# Altium project FIT_PM12_v1.1.PrjPcb (part 1 of 13)
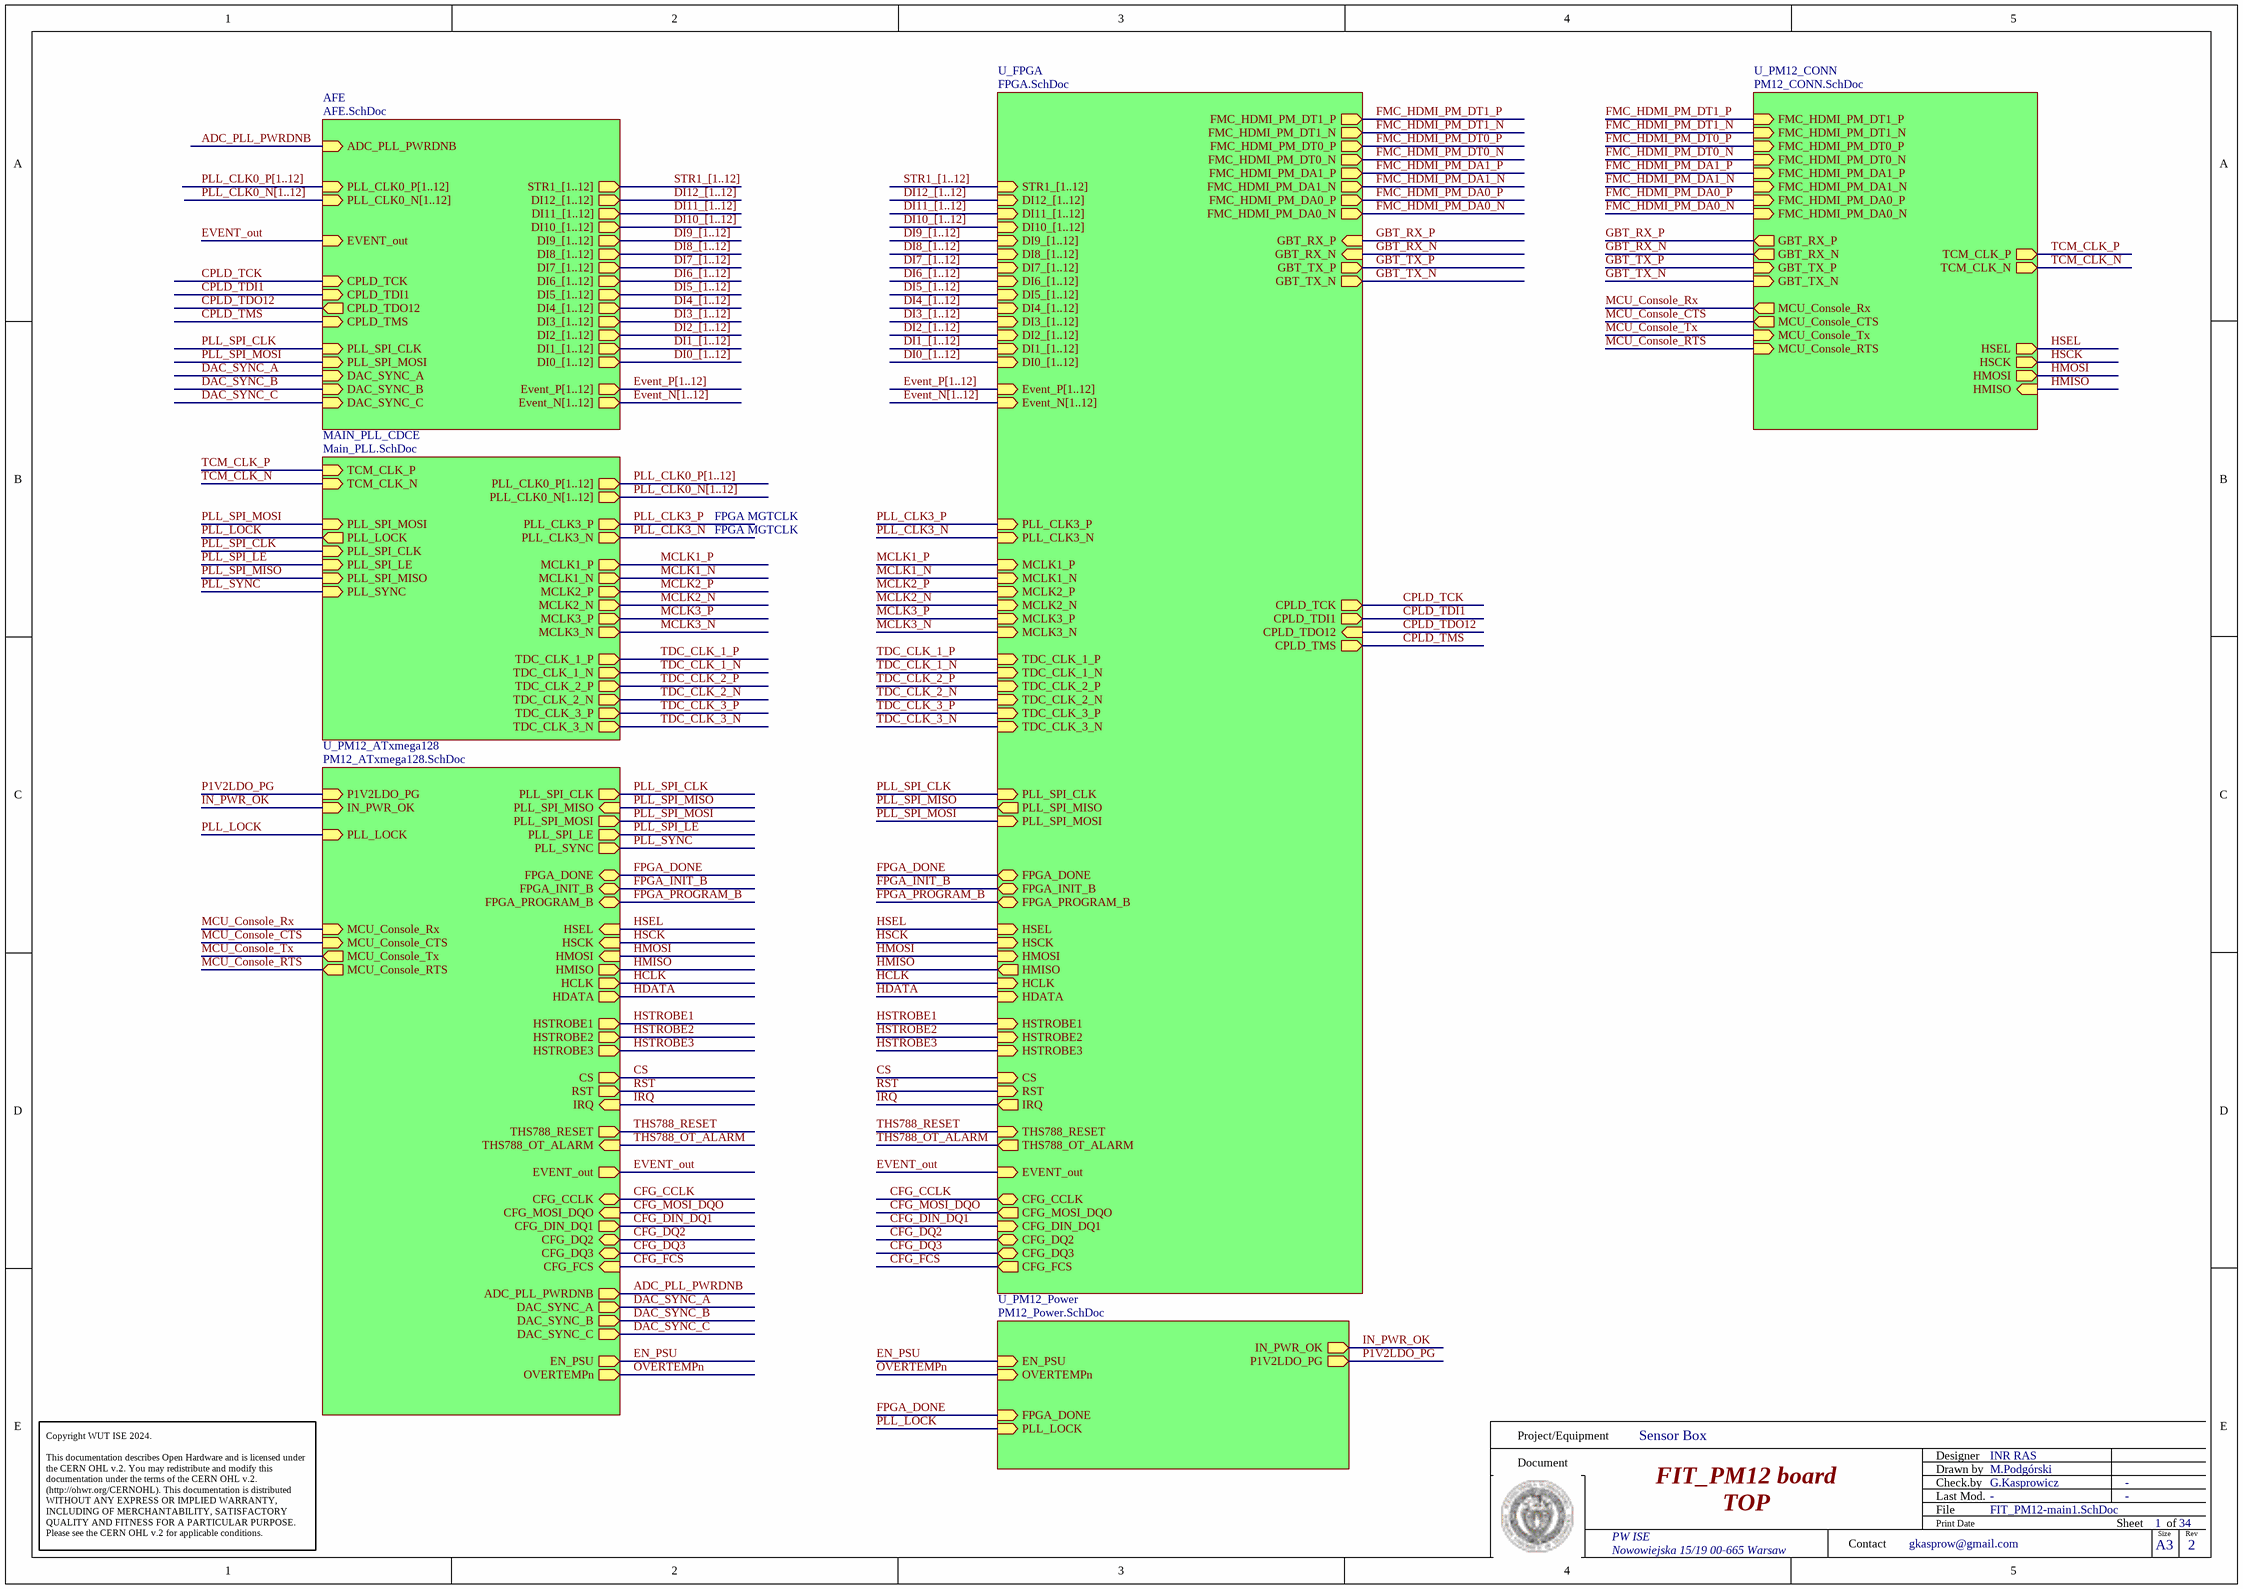
[diagram p0: FIT_PM12-main1.SchDoc]
35 sheets, 2151 parts. Net scope: hierarchical (ports join the sheet entries above them; power ports are global).
Board file: PM12_v1.1.PcbDoc
Sheets:
  FIT_PM12-main1.SchDoc
    MAIN_PLL_CDCE = Main_PLL.SchDoc
      U_ADCLK = ADCLK.SchDoc
    U_PM12_CONN = PM12_CONN.SchDoc
    U_PM12_ATxmega128 = PM12_ATxmega128.SchDoc
    U_PM12_Power = PM12_Power.SchDoc
      U_PM12_LDO = PM12_LDO.SchDoc
      U_PM12_Supply_LED = PM12_Supply_LED.SchDoc
      U_PM12_P3V8 = PM12_P3V8.SchDoc
      U_PM12_P3V3 = PM12_P3V3.SchDoc
      U_PM12_N5V5 = PM12_N5V5.SchDoc
      U_PM12_P5V5 = PM12_P5V5.SchDoc
      U_PM12_P1V0 = PM12_P1V0.SchDoc
      U_PM12_P1V8 = PM12_P1V8.SchDoc
    U_FPGA = FPGA.SchDoc
      U_FPGA_H = FPGA_H.SchDoc
        U_THS788_1 = THS788_1.SchDoc
      U_FPGA_D_F = FPGA_D_F.SchDoc
        U_THS788_3 = THS788_3.SchDoc
      U_FPGA_A_B = FPGA_A_B.SchDoc
      U_FPGA_G = FPGA_G.SchDoc
        U_THS788_2 = THS788_2.SchDoc
      U_FPGA_I_J = FPGA_I_J.SchDoc
      U_FPGA_E = FPGA_E.SchDoc
      U_FPGA_C = FPGA_C.SchDoc
      JTAG = JTAG.SchDoc
      U_FPGA_Power = FPGA_Power.SchDoc
    AFE = AFE.SchDoc
      INT1 = Integrators.SchDoc
      INT2 = Integrators.SchDoc
      INT3 = Integrators.SchDoc
      INT4 = Integrators.SchDoc
      INT5 = Integrators.SchDoc
      INT6 = Integrators.SchDoc
      INT7 = Integrators.SchDoc
      INT8 = Integrators.SchDoc
      INT9 = Integrators.SchDoc
      INT10 = Integrators.SchDoc
      INT11 = Integrators.SchDoc
      INT12 = Integrators.SchDoc
      ADC1 = ADCs.SchDoc
      ADC2 = ADCs.SchDoc
      ADC3 = ADCs.SchDoc
      ADC4 = ADCs.SchDoc
      ADC5 = ADCs.SchDoc
      ADC6 = ADCs.SchDoc
      ADC7 = ADCs.SchDoc
      ADC8 = ADCs.SchDoc
      ADC9 = ADCs.SchDoc
      ADC10 = ADCs.SchDoc
      ADC11 = ADCs.SchDoc
      ADC12 = ADCs.SchDoc
      CPLD1 = XC2C128.SchDoc
      CPLD2 = XC2C128.SchDoc
      CPLD3 = XC2C128.SchDoc
      CPLD4 = XC2C128.SchDoc
      CPLD5 = XC2C128.SchDoc
      CPLD6 = XC2C128.SchDoc
      CPLD7 = XC2C128.SchDoc
      CPLD8 = XC2C128.SchDoc
      CPLD9 = XC2C128.SchDoc
      CPLD10 = XC2C128.SchDoc
      CPLD11 = XC2C128.SchDoc
      CPLD12 = XC2C128.SchDoc
      QDC1 = DAC8554.SchDoc
      QDC2 = DAC8554.SchDoc
      QDC3 = DAC8554.SchDoc
      QDC4 = DAC8554.SchDoc
      QDC5 = DAC8554.SchDoc
      QDC6 = DAC8554.SchDoc
      QDC7 = DAC8554.SchDoc
      QDC8 = DAC8554.SchDoc
      QDC9 = DAC8554.SchDoc
      QDC10 = DAC8554.SchDoc
      QDC11 = DAC8554.SchDoc
      QDC12 = DAC8554.SchDoc
      ADC_PLL1 = ADC_PLL.SchDoc
      ADC_PLL2 = ADC_PLL.SchDoc
      ADC_PLL3 = ADC_PLL.SchDoc
      ADC_PLL4 = ADC_PLL.SchDoc
      ADC_PLL5 = ADC_PLL.SchDoc
      ADC_PLL6 = ADC_PLL.SchDoc
      ADC_PLL7 = ADC_PLL.SchDoc
      ADC_PLL8 = ADC_PLL.SchDoc
      ADC_PLL9 = ADC_PLL.SchDoc
      ADC_PLL10 = ADC_PLL.SchDoc
      ADC_PLL11 = ADC_PLL.SchDoc
      ADC_PLL12 = ADC_PLL.SchDoc
      Gate_Strobe1 = Gate_Strobe.SchDoc
      Gate_Strobe2 = Gate_Strobe.SchDoc
      Gate_Strobe3 = Gate_Strobe.SchDoc
      Gate_Strobe4 = Gate_Strobe.SchDoc
      Gate_Strobe5 = Gate_Strobe.SchDoc
      Gate_Strobe6 = Gate_Strobe.SchDoc
      Gate_Strobe7 = Gate_Strobe.SchDoc
      Gate_Strobe8 = Gate_Strobe.SchDoc
      Gate_Strobe9 = Gate_Strobe.SchDoc
      Gate_Strobe10 = Gate_Strobe.SchDoc
      Gate_Strobe11 = Gate_Strobe.SchDoc
      Gate_Strobe12 = Gate_Strobe.SchDoc
  I2C_Switch.SchDoc

## Sheet FIT_PM12-main1.SchDoc: FIT_PM12 board
size 420 x 297 mm; CheckedBy: G.Kasprowicz; Author: INR Moscow; CompanyName: WUT ISE; DrawnBy: M.Podgórski; Organization: WUT ISE; Address1: PW ISE; Address2: Nowowiejska 15/19 00-665 Warsaw; Address3: gkasprow@gmail.com; DocumentNumber: 1; Revision: 2; SheetNumber: 1; SheetTotal: 34; ModifiedBy: -; CheckedDate: -; Title2: TOP; DivGrp: WUT ISE; Designer: INR RAS; ModifiedDate: -; ProjectName: Sensor Box

### Sub-sheets
AFE = AFE.SchDoc: CPLD_TCK (in), CPLD_TMS (in), CPLD_TDI1 (in), CPLD_TDO12 (out), PLL_SPI_MOSI (in), DAC_SYNC_A (in), DAC_SYNC_B (in), DAC_SYNC_C (in), ADC_PLL_PWRDNB (in), EVENT_out (in), Event_P[1..12] (out), Event_N[1..12] (out), PLL_CLK0_P[1..12] (in), PLL_CLK0_N[1..12] (in), PLL_SPI_CLK (in), STR1_[1..12] (out), DI12_[1..12] (out), DI11_[1..12] (out), DI10_[1..12] (out), DI9_[1..12] (out), DI8_[1..12] (out), DI7_[1..12] (out), DI6_[1..12] (out), DI5_[1..12] (out), DI4_[1..12] (out), DI3_[1..12] (out), DI2_[1..12] (out), DI1_[1..12] (out), DI0_[1..12] (out)
MAIN_PLL_CDCE = Main_PLL.SchDoc: PLL_SPI_CLK (in), PLL_SPI_MISO (in), TCM_CLK_P (in), TCM_CLK_N (in), PLL_SYNC (in), PLL_LOCK (out), PLL_SPI_LE (in), PLL_SPI_MOSI (in), PLL_CLK3_P (out), PLL_CLK3_N (out), PLL_CLK0_P[1..12] (out), PLL_CLK0_N[1..12] (out), TDC_CLK_1_P (out), TDC_CLK_1_N (out), TDC_CLK_2_P (out), TDC_CLK_2_N (out), TDC_CLK_3_P (out), TDC_CLK_3_N (out), MCLK1_P (out), MCLK1_N (out), MCLK2_P (out), MCLK2_N (out), MCLK3_P (out), MCLK3_N (out)
U_FPGA = FPGA.SchDoc: FMC_HDMI_PM_DT1_P (out), FMC_HDMI_PM_DT1_N (out), FMC_HDMI_PM_DT0_P (out), FMC_HDMI_PM_DT0_N (out), FMC_HDMI_PM_DA1_P (out), FMC_HDMI_PM_DA1_N (out), FMC_HDMI_PM_DA0_P (out), FMC_HDMI_PM_DA0_N (out), HCLK (in), HDATA (in), HSTROBE3 (in), TDC_CLK_3_P (in), TDC_CLK_3_N (in), MCLK3_P (in), MCLK3_N (in), THS788_OT_ALARM (out), THS788_RESET (in), TDC_CLK_1_P (in), TDC_CLK_1_N (in), MCLK1_P (in), MCLK1_N (in), TDC_CLK_2_P (in), TDC_CLK_2_N (in), MCLK2_P (in), MCLK2_N (in), STR1_[1..12] (in), DI12_[1..12] (in), DI11_[1..12] (in), DI10_[1..12] (in), DI9_[1..12] (in), DI8_[1..12] (in), DI7_[1..12] (in), DI6_[1..12] (in), DI5_[1..12] (in), DI4_[1..12] (in), DI3_[1..12] (in), DI2_[1..12] (in), DI1_[1..12] (in), DI0_[1..12] (in), Event_P[1..12] (in), Event_N[1..12] (in), PLL_SPI_MOSI (in), PLL_SPI_CLK (in), PLL_SPI_MISO (out), CFG_MOSI_DQO (out), CFG_DIN_DQ1 (in), CFG_DQ2 (bidir), CFG_DQ3 (bidir), CFG_FCS (out), EVENT_out (in), HSEL (in), HSCK (in), HMOSI (in), HMISO (out), RST (in), CS (in), IRQ (out), PLL_CLK3_P (in), PLL_CLK3_N (in), GBT_RX_P (in), GBT_RX_N (in), GBT_TX_P (out), GBT_TX_N (out), CFG_CCLK (bidir), CPLD_TDO12 (in), FPGA_DONE (bidir), FPGA_INIT_B (bidir), FPGA_PROGRAM_B (bidir), CPLD_TCK (out), CPLD_TDI1 (out), CPLD_TMS (out), HSTROBE2 (in), HSTROBE1 (in)
U_PM12_ATxmega128 = PM12_ATxmega128.SchDoc: ADC_PLL_PWRDNB (out), PLL_SPI_MOSI (out), CFG_MOSI_DQO (in), CFG_DIN_DQ1 (out), CFG_DQ2 (bidir), CFG_DQ3 (bidir), CFG_FCS (in), CFG_CCLK (bidir), FPGA_DONE (bidir), FPGA_INIT_B (bidir), PLL_SPI_CLK (out), EVENT_out (out), PLL_SPI_MISO (in), CS (out), IRQ (in), RST (out), FPGA_PROGRAM_B (bidir), PLL_SYNC (out), PLL_LOCK (in), PLL_SPI_LE (out), IN_PWR_OK (in), MCU_Console_Rx (in), MCU_Console_CTS (in), MCU_Console_Tx (out), MCU_Console_RTS (out), EN_PSU (out), P1V2LDO_PG (in), THS788_RESET (out), THS788_OT_ALARM (in), OVERTEMPn (out), HSCK (in), HMISO (out), HSEL (in), HMOSI (in), HCLK (out), HDATA (out), HSTROBE1 (out), HSTROBE2 (out), HSTROBE3 (out), DAC_SYNC_A (out), DAC_SYNC_B (out), DAC_SYNC_C (out)
U_PM12_CONN = PM12_CONN.SchDoc: GBT_TX_P (in), GBT_TX_N (in), GBT_RX_P (out), GBT_RX_N (out), TCM_CLK_P (out), TCM_CLK_N (out), MCU_Console_Rx (out), MCU_Console_CTS (out), MCU_Console_Tx (in), MCU_Console_RTS (in), FMC_HDMI_PM_DT1_P (in), FMC_HDMI_PM_DT1_N (in), FMC_HDMI_PM_DT0_P (in), FMC_HDMI_PM_DT0_N (in), FMC_HDMI_PM_DA1_P (in), FMC_HDMI_PM_DA1_N (in), FMC_HDMI_PM_DA0_P (in), FMC_HDMI_PM_DA0_N (in), HSCK (out), HMISO (in), HSEL (out), HMOSI (out)
U_PM12_Power = PM12_Power.SchDoc: IN_PWR_OK (out), P1V2LDO_PG (out), EN_PSU (in), FPGA_DONE (in), OVERTEMPn (in), PLL_LOCK (in)

### Nets
ADC_PLL_PWRDNB: sheet U_PM12_ATxmega128/ADC_PLL_PWRDNB, sheet AFE/ADC_PLL_PWRDNB
CFG_CCLK: sheet U_PM12_ATxmega128/CFG_CCLK, sheet U_FPGA/CFG_CCLK
CFG_DIN_DQ1: sheet U_PM12_ATxmega128/CFG_DIN_DQ1, sheet U_FPGA/CFG_DIN_DQ1
CFG_DQ2: sheet U_PM12_ATxmega128/CFG_DQ2, sheet U_FPGA/CFG_DQ2
CFG_DQ3: sheet U_PM12_ATxmega128/CFG_DQ3, sheet U_FPGA/CFG_DQ3
CFG_FCS: sheet U_PM12_ATxmega128/CFG_FCS, sheet U_FPGA/CFG_FCS
CFG_MOSI_DQO: sheet U_PM12_ATxmega128/CFG_MOSI_DQO, sheet U_FPGA/CFG_MOSI_DQO
CPLD_TCK: sheet U_FPGA/CPLD_TCK, sheet AFE/CPLD_TCK
CPLD_TDI1: sheet U_FPGA/CPLD_TDI1, sheet AFE/CPLD_TDI1  [project net CPLD_TDI]
CPLD_TDO12: sheet U_FPGA/CPLD_TDO12, sheet AFE/CPLD_TDO12  [project net CPLD_TDO]
CPLD_TMS: sheet U_FPGA/CPLD_TMS, sheet AFE/CPLD_TMS
CS: sheet U_PM12_ATxmega128/CS, sheet U_FPGA/CS
DAC_SYNC_A: sheet U_PM12_ATxmega128/DAC_SYNC_A, sheet AFE/DAC_SYNC_A  [project net DAC_SYNC]
DAC_SYNC_B: sheet U_PM12_ATxmega128/DAC_SYNC_B, sheet AFE/DAC_SYNC_B  [project net DAC_SYNC]
DAC_SYNC_C: sheet U_PM12_ATxmega128/DAC_SYNC_C, sheet AFE/DAC_SYNC_C  [project net DAC_SYNC]
EN_PSU: sheet U_PM12_ATxmega128/EN_PSU, sheet U_PM12_Power/EN_PSU
EVENT_out: sheet U_PM12_ATxmega128/EVENT_out, sheet U_FPGA/EVENT_out, sheet AFE/EVENT_out  [project net EV_IN_]
FMC_HDMI_PM_DA0_N: sheet U_PM12_CONN/FMC_HDMI_PM_DA0_N, sheet U_FPGA/FMC_HDMI_PM_DA0_N
FMC_HDMI_PM_DA0_P: sheet U_PM12_CONN/FMC_HDMI_PM_DA0_P, sheet U_FPGA/FMC_HDMI_PM_DA0_P
FMC_HDMI_PM_DA1_N: sheet U_PM12_CONN/FMC_HDMI_PM_DA1_N, sheet U_FPGA/FMC_HDMI_PM_DA1_N
FMC_HDMI_PM_DA1_P: sheet U_PM12_CONN/FMC_HDMI_PM_DA1_P, sheet U_FPGA/FMC_HDMI_PM_DA1_P
FMC_HDMI_PM_DT0_N: sheet U_PM12_CONN/FMC_HDMI_PM_DT0_N, sheet U_FPGA/FMC_HDMI_PM_DT0_N
FMC_HDMI_PM_DT0_P: sheet U_PM12_CONN/FMC_HDMI_PM_DT0_P, sheet U_FPGA/FMC_HDMI_PM_DT0_P
FMC_HDMI_PM_DT1_N: sheet U_PM12_CONN/FMC_HDMI_PM_DT1_N, sheet U_FPGA/FMC_HDMI_PM_DT1_N
FMC_HDMI_PM_DT1_P: sheet U_PM12_CONN/FMC_HDMI_PM_DT1_P, sheet U_FPGA/FMC_HDMI_PM_DT1_P
FPGA_DONE: sheet U_PM12_ATxmega128/FPGA_DONE, sheet U_PM12_Power/FPGA_DONE, sheet U_FPGA/FPGA_DONE
FPGA_INIT_B: sheet U_PM12_ATxmega128/FPGA_INIT_B, sheet U_FPGA/FPGA_INIT_B
FPGA_PROGRAM_B: sheet U_PM12_ATxmega128/FPGA_PROGRAM_B, sheet U_FPGA/FPGA_PROGRAM_B
GBT_RX_N: sheet U_PM12_CONN/GBT_RX_N, sheet U_FPGA/GBT_RX_N
GBT_RX_P: sheet U_PM12_CONN/GBT_RX_P, sheet U_FPGA/GBT_RX_P
GBT_TX_N: sheet U_PM12_CONN/GBT_TX_N, sheet U_FPGA/GBT_TX_N
GBT_TX_P: sheet U_PM12_CONN/GBT_TX_P, sheet U_FPGA/GBT_TX_P
HCLK: sheet U_PM12_ATxmega128/HCLK, sheet U_FPGA/HCLK
HDATA: sheet U_PM12_ATxmega128/HDATA, sheet U_FPGA/HDATA
HMISO: sheet U_PM12_CONN/HMISO, sheet U_PM12_ATxmega128/HMISO, sheet U_FPGA/HMISO
HMOSI: sheet U_PM12_CONN/HMOSI, sheet U_PM12_ATxmega128/HMOSI, sheet U_FPGA/HMOSI
HSCK: sheet U_PM12_CONN/HSCK, sheet U_PM12_ATxmega128/HSCK, sheet U_FPGA/HSCK
HSEL: sheet U_PM12_CONN/HSEL, sheet U_PM12_ATxmega128/HSEL, sheet U_FPGA/HSEL
HSTROBE1: sheet U_PM12_ATxmega128/HSTROBE1, sheet U_FPGA/HSTROBE1
HSTROBE2: sheet U_PM12_ATxmega128/HSTROBE2, sheet U_FPGA/HSTROBE2
HSTROBE3: sheet U_PM12_ATxmega128/HSTROBE3, sheet U_FPGA/HSTROBE3
IN_PWR_OK: sheet U_PM12_ATxmega128/IN_PWR_OK, sheet U_PM12_Power/IN_PWR_OK
IRQ: sheet U_PM12_ATxmega128/IRQ, sheet U_FPGA/IRQ
MCLK1_N: sheet MAIN_PLL_CDCE/MCLK1_N, sheet U_FPGA/MCLK1_N
MCLK1_P: sheet MAIN_PLL_CDCE/MCLK1_P, sheet U_FPGA/MCLK1_P
MCLK2_N: sheet MAIN_PLL_CDCE/MCLK2_N, sheet U_FPGA/MCLK2_N
MCLK2_P: sheet MAIN_PLL_CDCE/MCLK2_P, sheet U_FPGA/MCLK2_P
MCLK3_N: sheet MAIN_PLL_CDCE/MCLK3_N, sheet U_FPGA/MCLK3_N
MCLK3_P: sheet MAIN_PLL_CDCE/MCLK3_P, sheet U_FPGA/MCLK3_P
MCU_Console_CTS: sheet U_PM12_CONN/MCU_Console_CTS, sheet U_PM12_ATxmega128/MCU_Console_CTS
MCU_Console_RTS: sheet U_PM12_CONN/MCU_Console_RTS, sheet U_PM12_ATxmega128/MCU_Console_RTS
MCU_Console_Rx: sheet U_PM12_CONN/MCU_Console_Rx, sheet U_PM12_ATxmega128/MCU_Console_Rx
MCU_Console_Tx: sheet U_PM12_CONN/MCU_Console_Tx, sheet U_PM12_ATxmega128/MCU_Console_Tx
OVERTEMPn: sheet U_PM12_ATxmega128/OVERTEMPn, sheet U_PM12_Power/OVERTEMPn
P1V2LDO_PG: sheet U_PM12_ATxmega128/P1V2LDO_PG, sheet U_PM12_Power/P1V2LDO_PG
PLL_CLK3_N: sheet MAIN_PLL_CDCE/PLL_CLK3_N, sheet U_FPGA/PLL_CLK3_N
PLL_CLK3_P: sheet MAIN_PLL_CDCE/PLL_CLK3_P, sheet U_FPGA/PLL_CLK3_P
PLL_LOCK: sheet MAIN_PLL_CDCE/PLL_LOCK, sheet U_PM12_ATxmega128/PLL_LOCK, sheet U_PM12_Power/PLL_LOCK
PLL_SPI_CLK: sheet MAIN_PLL_CDCE/PLL_SPI_CLK, sheet U_PM12_ATxmega128/PLL_SPI_CLK, sheet U_FPGA/PLL_SPI_CLK, sheet AFE/PLL_SPI_CLK
PLL_SPI_LE: sheet MAIN_PLL_CDCE/PLL_SPI_LE, sheet U_PM12_ATxmega128/PLL_SPI_LE
PLL_SPI_MISO: sheet MAIN_PLL_CDCE/PLL_SPI_MISO, sheet U_PM12_ATxmega128/PLL_SPI_MISO, sheet U_FPGA/PLL_SPI_MISO
PLL_SPI_MOSI: sheet MAIN_PLL_CDCE/PLL_SPI_MOSI, sheet U_PM12_ATxmega128/PLL_SPI_MOSI, sheet U_FPGA/PLL_SPI_MOSI, sheet AFE/PLL_SPI_MOSI
PLL_SYNC: sheet MAIN_PLL_CDCE/PLL_SYNC, sheet U_PM12_ATxmega128/PLL_SYNC
RST: sheet U_PM12_ATxmega128/RST, sheet U_FPGA/RST
TCM_CLK_N: sheet MAIN_PLL_CDCE/TCM_CLK_N, sheet U_PM12_CONN/TCM_CLK_N
TCM_CLK_P: sheet MAIN_PLL_CDCE/TCM_CLK_P, sheet U_PM12_CONN/TCM_CLK_P
TDC_CLK_1_N: sheet MAIN_PLL_CDCE/TDC_CLK_1_N, sheet U_FPGA/TDC_CLK_1_N
TDC_CLK_1_P: sheet MAIN_PLL_CDCE/TDC_CLK_1_P, sheet U_FPGA/TDC_CLK_1_P
TDC_CLK_2_N: sheet MAIN_PLL_CDCE/TDC_CLK_2_N, sheet U_FPGA/TDC_CLK_2_N
TDC_CLK_2_P: sheet MAIN_PLL_CDCE/TDC_CLK_2_P, sheet U_FPGA/TDC_CLK_2_P
TDC_CLK_3_N: sheet MAIN_PLL_CDCE/TDC_CLK_3_N, sheet U_FPGA/TDC_CLK_3_N
TDC_CLK_3_P: sheet MAIN_PLL_CDCE/TDC_CLK_3_P, sheet U_FPGA/TDC_CLK_3_P
THS788_OT_ALARM: sheet U_PM12_ATxmega128/THS788_OT_ALARM, sheet U_FPGA/THS788_OT_ALARM
THS788_RESET: sheet U_PM12_ATxmega128/THS788_RESET, sheet U_FPGA/THS788_RESET

### Buses and harness runs
bus DI0_[1..12] = sheet AFE/DI0_[1..12]
bus DI0_[1..12] = sheet U_FPGA/DI0_[1..12]
bus DI1_[1..12] = sheet AFE/DI1_[1..12]
bus DI1_[1..12] = sheet U_FPGA/DI1_[1..12]
bus DI2_[1..12] = sheet AFE/DI2_[1..12]
bus DI2_[1..12] = sheet U_FPGA/DI2_[1..12]
bus DI3_[1..12] = sheet AFE/DI3_[1..12]
bus DI3_[1..12] = sheet U_FPGA/DI3_[1..12]
bus DI4_[1..12] = sheet AFE/DI4_[1..12]
bus DI4_[1..12] = sheet U_FPGA/DI4_[1..12]
bus DI5_[1..12] = sheet AFE/DI5_[1..12]
bus DI5_[1..12] = sheet U_FPGA/DI5_[1..12]
bus DI6_[1..12] = sheet AFE/DI6_[1..12]
bus DI6_[1..12] = sheet U_FPGA/DI6_[1..12]
bus DI7_[1..12] = sheet AFE/DI7_[1..12]
bus DI7_[1..12] = sheet U_FPGA/DI7_[1..12]
bus DI8_[1..12] = sheet AFE/DI8_[1..12]
bus DI8_[1..12] = sheet U_FPGA/DI8_[1..12]
bus DI9_[1..12] = sheet AFE/DI9_[1..12]
bus DI9_[1..12] = sheet U_FPGA/DI9_[1..12]
bus DI10_[1..12] = sheet AFE/DI10_[1..12]
bus DI10_[1..12] = sheet U_FPGA/DI10_[1..12]
bus DI11_[1..12] = sheet AFE/DI11_[1..12]
bus DI11_[1..12] = sheet U_FPGA/DI11_[1..12]
bus DI12_[1..12] = sheet AFE/DI12_[1..12]
bus DI12_[1..12] = sheet U_FPGA/DI12_[1..12]
bus Event_N[1..12] = sheet AFE/Event_N[1..12]
bus Event_N[1..12] = sheet U_FPGA/Event_N[1..12]
bus Event_P[1..12] = sheet AFE/Event_P[1..12]
bus Event_P[1..12] = sheet U_FPGA/Event_P[1..12]
bus PLL_CLK0_N[1..12] = sheet AFE/PLL_CLK0_N[1..12]
bus PLL_CLK0_N[1..12] = sheet MAIN_PLL_CDCE/PLL_CLK0_N[1..12]
bus PLL_CLK0_P[1..12] = sheet AFE/PLL_CLK0_P[1..12]
bus PLL_CLK0_P[1..12] = sheet MAIN_PLL_CDCE/PLL_CLK0_P[1..12]
bus STR1_[1..12] = sheet AFE/STR1_[1..12]
bus STR1_[1..12] = sheet U_FPGA/STR1_[1..12]

### Notes on the sheet
- FPGA MGTCLK
- Project/Equipment
- Document
- Designer
- Drawn by
- Check.by
- Copyright WUT ISE 2024.
  This documentation describes Open Hardware and is licensed under the CERN OHL v.2. You may redistribute and modify this documentation under the terms of the CERN OHL v.2. (http://ohwr.org/CERNOHL). This documentation is distributed WITHOUT ANY EXPRESS OR IMPLIED WARRANTY, INCLUDING OF MERCHANTABILITY, SATISFACTORY QUALITY AND FITNESS FOR A PARTICULAR PURPOSE. Please see the CERN OHL v.2 for applicable conditions.
- Contact
- File
- Last Mod.
- Print Date
- Sheet
- Size
- A3
- of
- Rev

## Sheet Main_PLL.SchDoc: FIT_PM12 board
size 420 x 297 mm; CheckedBy: G.Kasprowicz; Author: INR Moscow; CompanyName: WUT ISE; DrawnBy: M.Podgórski; Organization: WUT ISE; Address1: PW ISE; Address2: Nowowiejska 15/19 00-665 Warsaw; Address3: gkasprow@gmail.com; DocumentNumber: 9; Revision: 2; SheetNumber: 2; SheetTotal: 34; ModifiedBy: -; CheckedDate: -; Title2: Clocking; DivGrp: WUT ISE; Designer: INR RAS; ModifiedDate: -; ProjectName: Sensor Box
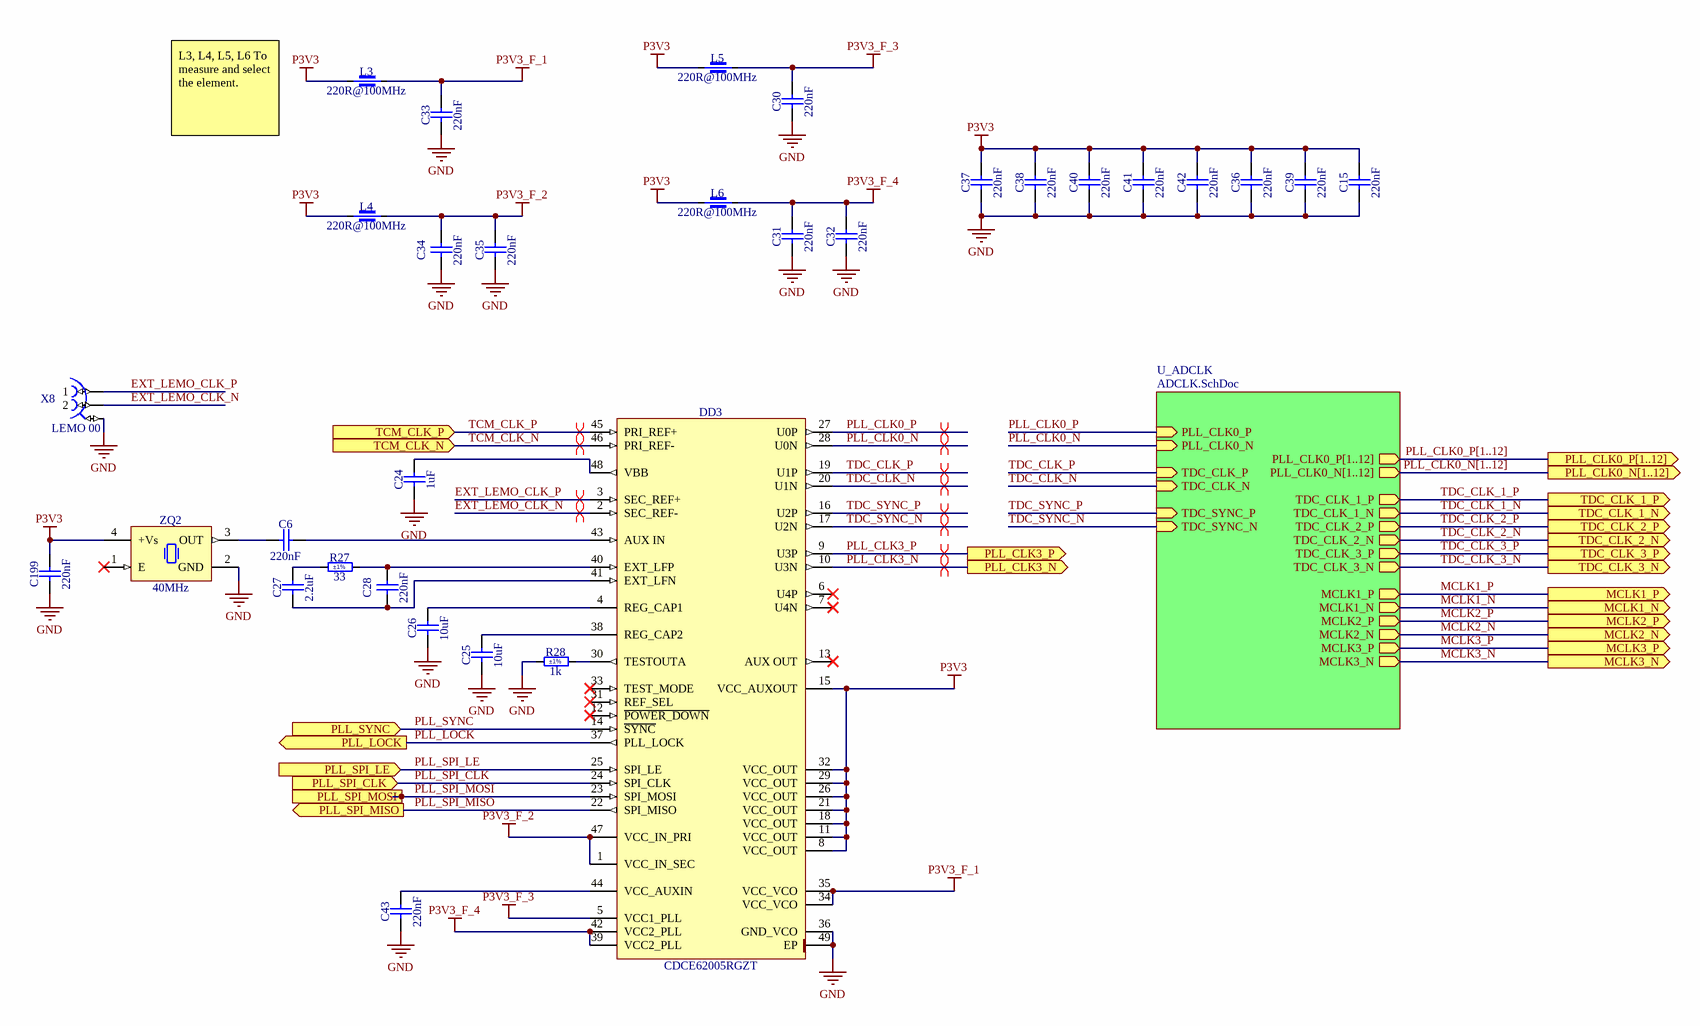
[diagram p1: Main_PLL.SchDoc]

### Parts
C6  220nF  [CAPC2012X135N]
C15  220nF  [CAPC2012X135N]
C24  1uF  [CAPC2012X140N]
C25  10uF  [CAPC2012X145N]
C26  10uF  [CAPC2012X145N]
C27  2.2uF  [CAPC2012X140N]
C28  220nF  [CAPC2012X135N]
C30  220nF  [CAPC2012X135N]
C31  220nF  [CAPC2012X135N]
C32  220nF  [CAPC2012X135N]
C33  220nF  [CAPC2012X135N]
C34  220nF  [CAPC2012X135N]
C35  220nF  [CAPC2012X135N]
C36  220nF  [CAPC2012X135N]
C37  220nF  [CAPC2012X135N]
C38  220nF  [CAPC2012X135N]
C39  220nF  [CAPC2012X135N]
C40  220nF  [CAPC2012X135N]
C41  220nF  [CAPC2012X135N]
C42  220nF  [CAPC2012X135N]
C43  220nF  [CAPC2012X135N]
C199  220nF  [CAPC2012X135N]
DD3  CDCE62005RGZT  [QFN50P700X700X100-49N-S570]
L3  220R@100MHz  [INDC2012X105N]
L4  220R@100MHz  [INDC2012X105N]
L5  220R@100MHz  [INDC2012X105N]
L6  220R@100MHz  [INDC2012X105N]
R27  33  Tolerance: ±1%  [RESC2012X60N]
R28  1k  Tolerance: ±1%  [RESC2012X60N]
X8  LEMO 00  [LEMO_EPG.00.302.NLN]
ZQ2  40MHz  [OSC_IQD_CFPS-73]

### Sub-sheets
U_ADCLK = ADCLK.SchDoc: PLL_CLK0_P[1..12] (out), PLL_CLK0_N[1..12] (out), PLL_CLK0_P (in), PLL_CLK0_N (in), TDC_CLK_N (in), TDC_CLK_P (in), TDC_SYNC_N (in), TDC_SYNC_P (in), TDC_CLK_1_P (out), TDC_CLK_1_N (out), TDC_CLK_3_P (out), TDC_CLK_3_N (out), TDC_CLK_2_P (out), TDC_CLK_2_N (out), MCLK3_P (out), MCLK3_N (out), MCLK2_P (out), MCLK2_N (out), MCLK1_P (out), MCLK1_N (out)

### Ports
MCLK1_N (out), MCLK1_P (out), MCLK2_N (out), MCLK2_P (out), MCLK3_N (out), MCLK3_P (out), PLL_CLK0_N[1..12] (out), PLL_CLK0_P[1..12] (out), PLL_CLK3_N (out), PLL_CLK3_P (out), PLL_LOCK (out), PLL_SPI_CLK (in), PLL_SPI_LE (in), PLL_SPI_MISO (out), PLL_SPI_MOSI (in), PLL_SYNC (in), TCM_CLK_N (in), TCM_CLK_P (in), TDC_CLK_1_N (out), TDC_CLK_1_P (out), TDC_CLK_2_N (out), TDC_CLK_2_P (out), TDC_CLK_3_N (out), TDC_CLK_3_P (out)

### Nets
GND: C15.1 C24.1 C25.1 C26.1 C30.1 C31.1 C32.1 C33.1 C34.1 C35.1 C36.1 C37.1 C38.1 C39.1 C40.1 C41.1 C42.1 C43.1 C199.1 DD3.36(GND_VCO) DD3.49(EP) R28.1 X8.3 ZQ2.2(GND)
P3V3: C15.2 C36.2 C37.2 C38.2 C39.2 C40.2 C41.2 C42.2 C199.2 DD3.8(VCC_OUT) DD3.11(VCC_OUT) DD3.15(VCC_AUXOUT) DD3.18(VCC_OUT) DD3.21(VCC_OUT) DD3.26(VCC_OUT) DD3.29(VCC_OUT) DD3.32(VCC_OUT) L3.1 L4.1 L5.1 L6.1 ZQ2.4(+Vs)
P3V3_F_1: C33.2 DD3.34(VCC_VCO) DD3.35(VCC_VCO) L3.2
P3V3_F_2: C34.2 C35.2 DD3.1(VCC_IN_SEC) DD3.47(VCC_IN_PRI) L4.2
P3V3_F_3: C30.2 DD3.5(VCC1_PLL) L5.2
P3V3_F_4: C31.2 C32.2 DD3.39(VCC2_PLL) DD3.42(VCC2_PLL) L6.2
EXT_LEMO_CLK_N: DD3.2(SEC_REF-) X8.2
EXT_LEMO_CLK_P: DD3.3(SEC_REF+) X8.1
MCLK1_N: port MCLK1_N, sheet U_ADCLK/MCLK1_N
MCLK1_P: port MCLK1_P, sheet U_ADCLK/MCLK1_P
MCLK2_N: port MCLK2_N, sheet U_ADCLK/MCLK2_N
MCLK2_P: port MCLK2_P, sheet U_ADCLK/MCLK2_P
MCLK3_N: port MCLK3_N, sheet U_ADCLK/MCLK3_N
MCLK3_P: port MCLK3_P, sheet U_ADCLK/MCLK3_P
PLL_CLK0_N: DD3.28(U0N) ; sheet U_ADCLK/PLL_CLK0_N
PLL_CLK0_P: DD3.27(U0P) ; sheet U_ADCLK/PLL_CLK0_P
PLL_CLK3_N: DD3.10(U3N) ; port PLL_CLK3_N
PLL_CLK3_P: DD3.9(U3P) ; port PLL_CLK3_P
PLL_LOCK: DD3.37(PLL_LOCK) ; port PLL_LOCK
PLL_SPI_CLK: DD3.24(SPI_CLK) ; port PLL_SPI_CLK
PLL_SPI_LE: DD3.25(SPI_LE) ; port PLL_SPI_LE
PLL_SPI_MISO: DD3.22(SPI_MISO) ; port PLL_SPI_MISO
PLL_SPI_MOSI: DD3.23(SPI_MOSI) ; port PLL_SPI_MOSI
PLL_SYNC: DD3.14(~{SYNC}) ; port PLL_SYNC
TCM_CLK_N: DD3.46(PRI_REF-) ; port TCM_CLK_N
TCM_CLK_P: DD3.45(PRI_REF+) ; port TCM_CLK_P
TDC_CLK_1_N: port TDC_CLK_1_N, sheet U_ADCLK/TDC_CLK_1_N
TDC_CLK_1_P: port TDC_CLK_1_P, sheet U_ADCLK/TDC_CLK_1_P
TDC_CLK_2_N: port TDC_CLK_2_N, sheet U_ADCLK/TDC_CLK_2_N
TDC_CLK_2_P: port TDC_CLK_2_P, sheet U_ADCLK/TDC_CLK_2_P
TDC_CLK_3_N: port TDC_CLK_3_N, sheet U_ADCLK/TDC_CLK_3_N
TDC_CLK_3_P: port TDC_CLK_3_P, sheet U_ADCLK/TDC_CLK_3_P
TDC_CLK_N: DD3.20(U1N) ; sheet U_ADCLK/TDC_CLK_N
TDC_CLK_P: DD3.19(U1P) ; sheet U_ADCLK/TDC_CLK_P
TDC_SYNC_N: DD3.17(U2N) ; sheet U_ADCLK/TDC_SYNC_N
TDC_SYNC_P: DD3.16(U2P) ; sheet U_ADCLK/TDC_SYNC_P
NetC6_1: C6.1 ZQ2.3(OUT)
NetC6_2: C6.2 DD3.43(AUX_IN)
NetC24_2: C24.2 DD3.48(VBB)
NetC25_2: C25.2 DD3.38(REG_CAP2)
NetC26_2: C26.2 DD3.4(REG_CAP1)
NetC27_1: C27.1 C28.1 DD3.41(EXT_LFN)
NetC27_2: C27.2 R27.1
NetC28_2: C28.2 DD3.40(EXT_LFP) R27.2
NetC43_2: C43.2 DD3.44(VCC_AUXIN)
NetDD3_30: DD3.30(TESTOUTA) R28.2

Not connected (* = marked no-connect by the designer): DD3 6(U4P)* 7(U4N)* 12(~{POWER_DOWN})* 13(AUX_OUT)* 31(REF_SEL)* 33(TEST_MODE)*; ZQ2 1(E)*

### Buses and harness runs
bus PLL_CLK0_N[1..12] = port PLL_CLK0_N[1..12] = sheet U_ADCLK/PLL_CLK0_N[1..12]
bus PLL_CLK0_P[1..12] = port PLL_CLK0_P[1..12] = sheet U_ADCLK/PLL_CLK0_P[1..12]

### Layout directives
differential pair: EXT_LEMO_CLK_N, EXT_LEMO_CLK_P, PLL_CLK0_N, PLL_CLK0_P, PLL_CLK3_N, PLL_CLK3_P, TCM_CLK_N, TCM_CLK_P, TDC_CLK_N, TDC_CLK_P, TDC_SYNC_N, TDC_SYNC_P

### Notes on the sheet
- L3, L4, L5, L6 To measure and select the element.
- Project/Equipment
- Document
- Designer
- Drawn by
- Check.by
- Copyright WUT ISE 2024.
  This documentation describes Open Hardware and is licensed under the CERN OHL v.2. You may redistribute and modify this documentation under the terms of the CERN OHL v.2. (http://ohwr.org/CERNOHL). This documentation is distributed WITHOUT ANY EXPRESS OR IMPLIED WARRANTY, INCLUDING OF MERCHANTABILITY, SATISFACTORY QUALITY AND FITNESS FOR A PARTICULAR PURPOSE. Please see the CERN OHL v.2 for applicable conditions.
- Contact
- File
- Last Mod.
- Print Date
- Sheet
- Size
- A3
- of
- Rev

### Library data of the parts
C6 C15 C28 C30-C43 C199 = CC0805_220NF_50V_10%_X7R: Non-polarised capacitor; Part Description: SMD Multilayer Chip Ceramic Capacitor; Manufacturer: GENERIC; Manufacturer1 Part Number: GRM21BR71H224KA01L; Voltage: 50V; TC: X7R; Tolerance: ±10%; Part Number: CC0805_220NF_50V_10%_X7R; Component Kind: Standard; Component Type: Standard; Pin Count: 2; Value: 220nF; Status: Preferred; Manufacturer Part Number: CC0805_220NF_50V_10%_X7R; Case: 0805; Mounted: Yes; Socket: No; SMD: Yes; Sense: No; Manufacturer1 Example: MURATA; Manufacturer1 ComponentHeight: 1.35mm; HelpURL: \\cern.ch\dfs\Applications\Altium\Datasheets\CC0805_X7R_MURATA.pdf; Author: CERN DEM JLC; CreateDate: 03.12.2007; LatestRevisionDate: 03.12.2007
C24 = CC0805_1UF_25V_10%_X7R: Non-polarised capacitor; Part Description: SMD Multilayer Chip Ceramic Capacitor; Manufacturer: GENERIC; Manufacturer1 Part Number: C0805C105K3RAC; Voltage: 25V; TC: X7R; Tolerance: ±10%; Part Number: CC0805_1UF_25V_10%_X7R; Component Kind: Standard; Component Type: Standard; Pin Count: 2; Value: 1uF; Status: Preferred; Manufacturer Part Number: CC0805_1UF_25V_10%_X7R; Case: 0805; Mounted: Yes; Socket: No; SMD: Yes; Sense: No; Manufacturer1 Example: KEMET; Manufacturer1 ComponentHeight: 1.4mm; HelpURL: \\cern.ch\dfs\Applications\Altium\Datasheets\CC0805_X7R_KEMET.pdf; Author: CERN DEM JLC; CreateDate: 23.03.2009; LatestRevisionDate: 23.03.2009
C25 C26 = CC0805_10UF_25V_10%_X7R: Non-polarised capacitor; Part Description: SMD Multilayer Chip Ceramic Capacitor; Manufacturer: GENERIC; Manufacturer1 Part Number: GRM21BZ71E106KE15; Voltage: 25V; TC: X7R; Tolerance: ±10%; Part Number: CC0805_10UF_25V_10%_X7R; Component Kind: Standard; Component Type: Standard; Pin Count: 2; Value: 10uF; Status: Preferred; Manufacturer Part Number: CC0805_10UF_25V_10%_X7R; Case: 0805; Mounted: Yes; Socket: No; SMD: Yes; Sense: No; Manufacturer1 Example: MURATA; Manufacturer1 ComponentHeight: 1.45mm; HelpURL: \\cern.ch\dfs\Applications\Altium\Datasheets\CC0805_MURATA_GRM21BZ71E106KE15.pdf; Author: CERN DEM HF; CreateDate: 16.05.2023; LatestRevisionDate: 16.05.2023
C27 = CC0805_2.2UF_50V_10%_X7R: Non-polarised capacitor; Part Description: SMD Multilayer Chip Ceramic Capacitor; Manufacturer: GENERIC; Manufacturer1 Part Number: GRM21BR61H225KA73L; Voltage: 50V; TC: X7R; Tolerance: ±10%; Part Number: CC0805_2.2UF_50V_10%_X7R; Component Kind: Standard; Component Type: Standard; Pin Count: 2; Value: 2.2uF; Status: Preferred; Manufacturer Part Number: CC0805_2.2UF_50V_10%_X7R; Case: 0805; Mounted: Yes; Socket: No; SMD: Yes; Sense: No; Manufacturer1 Example: MURATA; Manufacturer1 ComponentHeight: 1.40mm; HelpURL: \\cern.ch\dfs\Applications\Altium\Datasheets\CC0805_X7R_MURATA_GRM.pdf; Author: CERN DEM JLC; CreateDate: 18.08.2014; LatestRevisionDate: 18.08.2014
DD3 = CDCE62005RGZT: 5/10 Outputs Clock Generator/Jitter Cleaner with Integrated Dual VCO; Manufacturer: TEXAS INSTRUMENTS; PressFit: No; Bonding: No; Part Number: CDCE62005RGZT; Component Kind: Standard; Component Type: Standard; Device: CDCE62005RGZT; PackageDescription: QFN, 0.50mm Pitch, Square; 48 Pin, 7.00mm L X 7.00mm W X 1.00mm H body (w/Thermal Tab 5.70 X 5.70mm), IPC Medium Density; Part Description: 5/10 Outputs Clock Generator/Jitter Cleaner with Integrated Dual VCO; Manufacturer Part Number: CDCE62005RGZ; Pin Count: 49; Case: QFN48; Mounted: Yes; Socket: No; SMD: Yes; Sense: No; ComponentHeight: 1mm; HelpURL: \\cern.ch\dfs\Applications\Altium\Datasheets\CDCE62005RGZT.pdf; Author: CERN DEM JLC; CreateDate: 21.11.2011; LatestRevisionDate: 10.06.2022
L3-L6 = IND0805_TDK_MPZ2012S221A: Part Description: SMT Chip Bead for General Power Line (MPZ Series); Manufacturer: TDK; Power: 3A; Resistance: 0.04R; Tolerance: ±25%; Part Number: IND0805_TDK_MPZ2012S221A; Component Kind: Standard; Component Type: Standard; Pin Count: 2; Value: 220R@100MHz; Manufacturer Part Number: MPZ2012S221A; Case: 0805; Mounted: Yes; Socket: No; SMD: Yes; Sense: No; ComponentHeight: 1.05mm; HelpURL: \\cern.ch\dfs\Applications\Altium\Datasheets\IND0805_TDK_MPZ2012.pdf; Author: CERN DEM HF; CreateDate: 04.10.2021; LatestRevisionDate: 04.10.2021
R27 = R0805_33R_1%_0.125W_100PPM: Resistor - 1%; Part Description: General Purpose Thick Film Chip Resistor; Manufacturer: GENERIC; Manufacturer1 Part Number: NRC10F33R0TRF; Power: 0.125W; TC: ±100ppm/°C; PressFit: No; Part Number: R0805_33R_1%_0.125W_100PPM; Component Kind: Standard; Component Type: Standard; Pin Count: 2; Value: 33; Status: Preferred; Manufacturer Part Number: R0805_33R_1%_0.125W_100PPM; Case: 0805; Mounted: Yes; Sense: No; Socket: No; SMD: Yes; Manufacturer1 Example: NIC COMPONENT; Manufacturer1 ComponentHeight: 0.6mm; HelpURL: \\cern.ch\dfs\Applications\Altium\Datasheets\R0805_NIC_NRC.pdf; Author: CERN DEM JLC; CreateDate: 03.12.2007; LatestRevisionDate: 13.03.2008
R28 = R0805_1K_1%_0.125W_100PPM: Resistor - 1%; Part Description: General Purpose Thick Film Chip Resistor; Manufacturer: GENERIC; Manufacturer1 Part Number: NRC10F1001TRF; Power: 0.125W; TC: ±100ppm/°C; PressFit: No; Part Number: R0805_1K_1%_0.125W_100PPM; Component Kind: Standard; Component Type: Standard; Pin Count: 2; Value: 1k; Status: Preferred; Manufacturer Part Number: R0805_1K_1%_0.125W_100PPM; Case: 0805; Mounted: Yes; Sense: No; Socket: No; SMD: Yes; Manufacturer1 Example: NIC COMPONENT; Manufacturer1 ComponentHeight: 0.6mm; HelpURL: \\cern.ch\dfs\Applications\Altium\Datasheets\R0805_NIC_NRC.pdf; Author: CERN DEM JLC; CreateDate: 03.12.2007; LatestRevisionDate: 13.03.2008
X8 = LEMO_EPG.00.302.NLN: Part Description: Size 00, Elbow Socket (90°) with 2 Female Contacts and Alignment Key (G); PressFit: No; SCEM: 09.31.28.007.2; Part Number: LEMO_EPG.00.302.NLN; Component Kind: Standard; Component Type: Standard; Pin Count: 3; Family: LEMO 00; Mounted: Yes; Socket: No; SMD: No; Sense: No; Status: None; Manufacturer: LEMO; Manufacturer Part Number: EPG.00.302.NLN; ComponentHeight: 7mm; HelpURL: \\cern.ch\dfs\Applications\Altium\Datasheets\LEMO_EPG.00.302.NLN.pdf; Author: CERN DEM JLC; CreateDate: 25.08.2010; LatestRevisionDate: 20.12.2010
ZQ2 = OSC_40MHZ_IQD_LFSPXO018042: Oscillator 4 pins 1=E 2=GND 3=OUT 4=+Vs; Part Description: 3.3V, ±50ppm, 50pF, 0..70°C, HCMOS Surface Mount Clock Oscillator (CFPS-73 Series); Manufacturer: IQD FREQUENCY PRODUCTS; PressFit: No; Bonding: No; Part Number: OSC_40MHZ_IQD_LFSPXO018042; Component Kind: Standard; Component Type: Standard; PackageDescription: Oscillator, Side Concave, 5.08mm Pitch, 4 Pins, 5.00mm L X 7.00mm W X 1.40mm H, CFPS-73 Series; Value: 40MHz; Manufacturer Part Number: LFSPXO018042; Pin Count: 4; Mounted: Yes; Socket: No; SMD: Yes; Sense: No; ComponentHeight: 1.4mm; HelpURL: \\cern.ch\dfs\Applications\Altium\Datasheets\OSC_IQD_LFSPXO018042.pdf; Author: CERN DEM JLC; CreateDate: 22.08.2011; LatestRevisionDate: 03.11.2016

## Sheet ADCLK.SchDoc: FIT_PM12 board
size 420 x 297 mm; CheckedBy: G.Kasprowicz; Author: INR Moscow; CompanyName: WUT ISE; DrawnBy: M.Podgórski; Organization: WUT ISE; Address1: PW ISE; Address2: Nowowiejska 15/19 00-665 Warsaw; Address3: gkasprow@gmail.com; DocumentNumber: 10; Revision: 2; SheetNumber: 3; SheetTotal: 34; ModifiedBy: -; CheckedDate: -; Title2: clock distribution; DivGrp: WUT ISE; Designer: INR RAS; ModifiedDate: -; ProjectName: Sensor Box
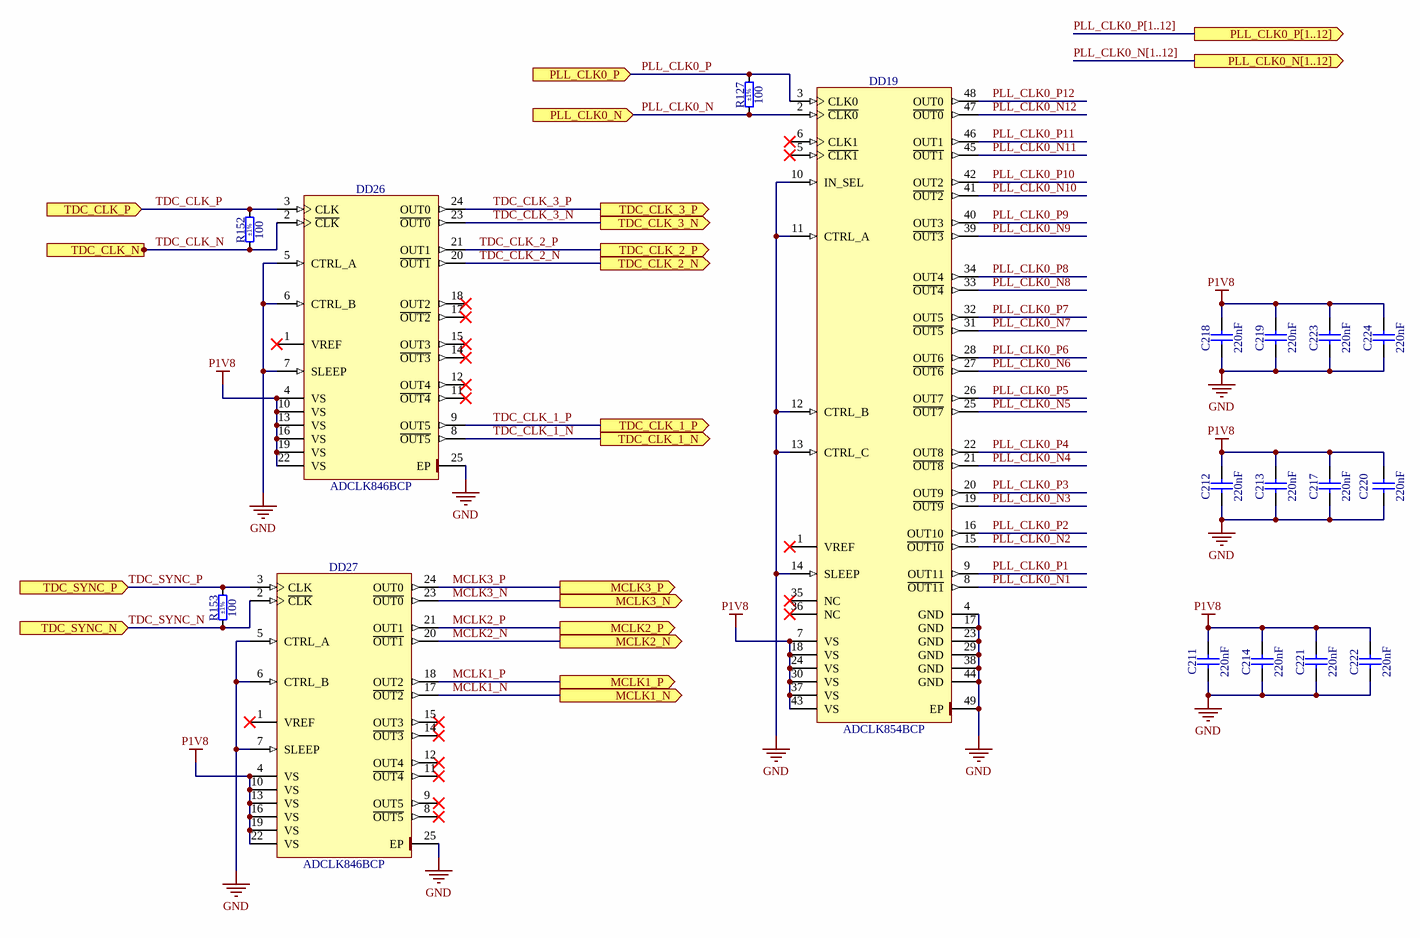
[diagram p2: ADCLK.SchDoc]

### Parts
(Parts that share a designator on the sheet are numbered #1, #2 ... from top to bottom, then left to right.)
C211#1  220nF  [CAPC2012X135N]
C212  220nF  [CAPC2012X135N]
C213  220nF  [CAPC2012X135N]
C214  220nF  [CAPC2012X135N]
C217  220nF  [CAPC2012X135N]
C218  220nF  [CAPC2012X135N]
C219  220nF  [CAPC2012X135N]
C220  220nF  [CAPC2012X135N]
C221  220nF  [CAPC2012X135N]
C222  220nF  [CAPC2012X135N]
C223  220nF  [CAPC2012X135N]
C224  220nF  [CAPC2012X135N]
DD19  ADCLK854BCP  [QFN50P700X700X80-49N-S290]
DD26  ADCLK846BCP  [QFN50P400X400X80-25N-S245]
DD27  ADCLK846BCP  [QFN50P400X400X80-25N-S245]
R127  100  Tolerance: ±1%  [RESC1608X55N]
R152#1  100  Tolerance: ±1%  [RESC1608X55N]
R153  100  Tolerance: ±1%  [RESC1608X55N]

### Ports
MCLK1_N (out), MCLK1_P (out), MCLK2_N (out), MCLK2_P (out), MCLK3_N (out), MCLK3_P (out), PLL_CLK0_N (in), PLL_CLK0_N[1..12] (out), PLL_CLK0_P (in), PLL_CLK0_P[1..12] (out), TDC_CLK_1_N (out), TDC_CLK_1_P (out), TDC_CLK_2_N (out), TDC_CLK_2_P (out), TDC_CLK_3_N (out), TDC_CLK_3_P (out), TDC_CLK_N (in), TDC_CLK_P (in), TDC_SYNC_N (in), TDC_SYNC_P (in)

### Nets
GND: C211#1.1 C212.1 C213.1 C214.1 C217.1 C218.1 C219.1 C220.1 C221.1 C222.1 C223.1 C224.1 DD19.4(GND) DD19.10(IN_SEL) DD19.11(CTRL_A) DD19.12(CTRL_B) DD19.13(CTRL_C) DD19.14(SLEEP) DD19.17(GND) DD19.23(GND) DD19.29(GND) DD19.38(GND) DD19.44(GND) DD19.49(EP) DD26.5(CTRL_A) DD26.6(CTRL_B) DD26.7(SLEEP) DD26.25(EP) DD27.5(CTRL_A) DD27.6(CTRL_B) DD27.7(SLEEP) DD27.25(EP)
P1V8: C211#1.2 C212.2 C213.2 C214.2 C217.2 C218.2 C219.2 C220.2 C221.2 C222.2 C223.2 C224.2 DD19.7(VS) DD19.18(VS) DD19.24(VS) DD19.30(VS) DD19.37(VS) DD19.43(VS) DD26.4(VS) DD26.10(VS) DD26.13(VS) DD26.16(VS) DD26.19(VS) DD26.22(VS) DD27.4(VS) DD27.10(VS) DD27.13(VS) DD27.16(VS) DD27.19(VS) DD27.22(VS)
MCLK1_N: DD27.17(~{OUT2}) ; port MCLK1_N
MCLK1_P: DD27.18(OUT2) ; port MCLK1_P
MCLK2_N: DD27.20(~{OUT1}) ; port MCLK2_N
MCLK2_P: DD27.21(OUT1) ; port MCLK2_P
MCLK3_N: DD27.23(~{OUT0}) ; port MCLK3_N
MCLK3_P: DD27.24(OUT0) ; port MCLK3_P
PLL_CLK0_N: DD19.2(~{CLK0}) R127.1 ; port PLL_CLK0_N
PLL_CLK0_N1: DD19.8(~{OUT11})  [project net PLL_CLK0_N]
PLL_CLK0_N2: DD19.15(~{OUT10})  [project net PLL_CLK0_N]
PLL_CLK0_N3: DD19.19(~{OUT9})  [project net PLL_CLK0_N]
PLL_CLK0_N4: DD19.21(~{OUT8})  [project net PLL_CLK0_N]
PLL_CLK0_N5: DD19.25(~{OUT7})  [project net PLL_CLK0_N]
PLL_CLK0_N6: DD19.27(~{OUT6})  [project net PLL_CLK0_N]
PLL_CLK0_N7: DD19.31(~{OUT5})  [project net PLL_CLK0_N]
PLL_CLK0_N8: DD19.33(~{OUT4})  [project net PLL_CLK0_N]
PLL_CLK0_N9: DD19.39(~{OUT3})  [project net PLL_CLK0_N]
PLL_CLK0_N10: DD19.41(~{OUT2})  [project net PLL_CLK0_N]
PLL_CLK0_N11: DD19.45(~{OUT1})  [project net PLL_CLK0_N]
PLL_CLK0_N12: DD19.47(~{OUT0})  [project net PLL_CLK0_N]
PLL_CLK0_P: DD19.3(CLK0) R127.2 ; port PLL_CLK0_P
PLL_CLK0_P1: DD19.9(OUT11)  [project net PLL_CLK0_P]
PLL_CLK0_P2: DD19.16(OUT10)  [project net PLL_CLK0_P]
PLL_CLK0_P3: DD19.20(OUT9)  [project net PLL_CLK0_P]
PLL_CLK0_P4: DD19.22(OUT8)  [project net PLL_CLK0_P]
PLL_CLK0_P5: DD19.26(OUT7)  [project net PLL_CLK0_P]
PLL_CLK0_P6: DD19.28(OUT6)  [project net PLL_CLK0_P]
PLL_CLK0_P7: DD19.32(OUT5)  [project net PLL_CLK0_P]
PLL_CLK0_P8: DD19.34(OUT4)  [project net PLL_CLK0_P]
PLL_CLK0_P9: DD19.40(OUT3)  [project net PLL_CLK0_P]
PLL_CLK0_P10: DD19.42(OUT2)  [project net PLL_CLK0_P]
PLL_CLK0_P11: DD19.46(OUT1)  [project net PLL_CLK0_P]
PLL_CLK0_P12: DD19.48(OUT0)  [project net PLL_CLK0_P]
TDC_CLK_1_N: DD26.8(~{OUT5}) ; port TDC_CLK_1_N
TDC_CLK_1_P: DD26.9(OUT5) ; port TDC_CLK_1_P
TDC_CLK_2_N: DD26.20(~{OUT1}) ; port TDC_CLK_2_N
TDC_CLK_2_P: DD26.21(OUT1) ; port TDC_CLK_2_P
TDC_CLK_3_N: DD26.23(~{OUT0}) ; port TDC_CLK_3_N
TDC_CLK_3_P: DD26.24(OUT0) ; port TDC_CLK_3_P
TDC_CLK_N: DD26.2(~{CLK}) R152#1.1 ; port TDC_CLK_N
TDC_CLK_P: DD26.3(CLK) R152#1.2 ; port TDC_CLK_P
TDC_SYNC_N: DD27.2(~{CLK}) R153.1 ; port TDC_SYNC_N
TDC_SYNC_P: DD27.3(CLK) R153.2 ; port TDC_SYNC_P

Not connected (* = marked no-connect by the designer): DD19 1(VREF)* 5(~{CLK1})* 6(CLK1)* 35(NC)* 36(NC)*; DD26 1(VREF)* 11(~{OUT4})* 12(OUT4)* 14(~{OUT3})* 15(OUT3)* 17(~{OUT2})* 18(OUT2)*; DD27 1(VREF)* 8(~{OUT5})* 9(OUT5)* 11(~{OUT4})* 12(OUT4)* 14(~{OUT3})* 15(OUT3)*

### Buses and harness runs
bus PLL_CLK0_N[1..12] = port PLL_CLK0_N[1..12]
bus PLL_CLK0_P[1..12] = port PLL_CLK0_P[1..12]

### Notes on the sheet
- Project/Equipment
- Document
- Designer
- Drawn by
- Check.by
- Copyright WUT ISE 2024.
  This documentation describes Open Hardware and is licensed under the CERN OHL v.2. You may redistribute and modify this documentation under the terms of the CERN OHL v.2. (http://ohwr.org/CERNOHL). This documentation is distributed WITHOUT ANY EXPRESS OR IMPLIED WARRANTY, INCLUDING OF MERCHANTABILITY, SATISFACTORY QUALITY AND FITNESS FOR A PARTICULAR PURPOSE. Please see the CERN OHL v.2 for applicable conditions.
- Contact
- File
- Last Mod.
- Print Date
- Sheet
- Size
- A3
- of
- Rev

### Library data of the parts
C211#1 C212-C214 C217-C224 = CC0805_220NF_50V_10%_X7R: as C6 on sheet Main_PLL; Part Number: CC0805_220NF_50V_10%_X7R; Component Kind: Standard; Component Type: Standard; Pin Count: 2; Value: 220nF; Status: Preferred; Manufacturer Part Number: CC0805_220NF_50V_10%_X7R; Case: 0805; Mounted: Yes; Socket: No; SMD: Yes; Sense: No; Manufacturer1 Example: MURATA; Manufacturer1 ComponentHeight: 1.35mm; HelpURL: \\cern.ch\dfs\Applications\Altium\Datasheets\CC0805_X7R_MURATA.pdf; Author: CERN DEM JLC; CreateDate: 03.12.2007; LatestRevisionDate: 03.12.2007
DD19 = ADCLK854BCP: 1.8 V, 6 LVDS/12 CMOS Outputs Low Power Clock Fanout Buffer; Manufacturer: ANALOG DEVICES; PressFit: No; Bonding: No; Part Number: ADCLK854BCP; Component Kind: Standard; Component Type: Standard; Device: ADCLK854BCP; PackageDescription: QFN, 0.50mm Pitch, Square; 48 Pin, 7.00mm L X 7.00mm W X 0.80mm H body (w/Thermal Tab 2.9 x 2.9mm), IPC Medium Density; Part Description: 1.8 V, 6 LVDS/12 CMOS Outputs Low Power Clock Fanout Buffer; Manufacturer Part Number: ADCLK854BCP; Pin Count: 49; Case: QFN48; Mounted: Yes; Socket: No; SMD: Yes; Sense: No; ComponentHeight: 0.8mm; Author: CERN DEM HF; HelpURL: \\cern.ch\dfs\Applications\Altium\Datasheets\ADCLK854BCP.pdf; CreateDate: 24.05.2024; LatestRevisionDate: 24.05.2024
DD26 DD27 = ADCLK846BCP: 1.8 V, 6 LVDS/12 CMOS Outputs Low Power Clock Fanout Buffer; Manufacturer: ANALOG DEVICES; PressFit: No; Bonding: No; Part Number: ADCLK846BCP; Component Kind: Standard; Component Type: Standard; Device: ADCLK846BCP; PackageDescription: QFN, 0.50mm Pitch, Square; 24 Pin, 4.00mm L X 4.00mm W X 0.80mm H body (w/Thermal Tab 2.45 x 2.45mm), IPC Medium Density; Part Description: 1.8 V, 6 LVDS/12 CMOS Outputs Low Power Clock Fanout Buffer; Manufacturer Part Number: ADCLK846BCP; Pin Count: 25; Case: QFN24; Mounted: Yes; Socket: No; SMD: Yes; Sense: No; ComponentHeight: 0.8mm; Author: CERN DEM HF; HelpURL: \\cern.ch\dfs\Applications\Altium\Datasheets\ADCLK846BCP.pdf; CreateDate: 23.05.2024; LatestRevisionDate: 23.05.2024
R127 R152#1 R153 = R0603_100R_1%_0.1W_100PPM: Resistor - 1%; Part Description: General Purpose Thick Film Chip Resistor; Manufacturer: GENERIC; Manufacturer1 Part Number: NRC06F4700TRF; Power: 0.1W; TC: ±100ppm/°C; PressFit: No; Part Number: R0603_100R_1%_0.1W_100PPM; Component Kind: Standard; Component Type: Standard; Pin Count: 2; Value: 100; Status: Preferred; Manufacturer Part Number: R0603_100R_1%_0.1W_100PPM; Case: 0603; Mounted: Yes; Sense: No; Socket: No; SMD: Yes; Manufacturer1 Example: NIC COMPONENT; Manufacturer1 ComponentHeight: 0.55mm; HelpURL: \\cern.ch\dfs\Applications\Altium\Datasheets\R0603_NIC_NRC.pdf; Author: CERN DEM JLC; CreateDate: 03.12.2007; LatestRevisionDate: 13.03.2008